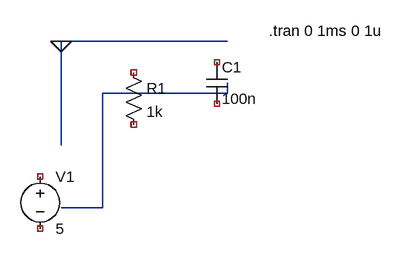
[diagram p0: schematic basic_rc.asc]
basic_rc.asc, the LTspice schematic file:
Version 4
SHEET 1 880 680
SYMBOL voltage 32 256 R0
SYMATTR InstName V1
SYMATTR Value 5
SYMBOL res 160 96 R0
SYMATTR InstName R1
SYMATTR Value 1k
SYMBOL cap 288 96 R0
SYMATTR InstName C1
SYMATTR Value 100n
WIRE 64 320 128 320
WIRE 128 320 128 144
WIRE 128 144 192 144
WIRE 192 144 320 144
WIRE 320 144 320 128
WIRE 64 224 64 64
WIRE 64 64 192 64
WIRE 192 64 320 64
FLAG 64 64 0
TEXT 384 48 Left 2 !.tran 0 1ms 0 1u

The netlist it stands for:
* basic_rc.asc
V1 NC_01 NC_02 5
R1 NC_03 NC_04 1k
C1 NC_05 NC_06 100n
.tran 0 1ms 0 1u
.backanno
.end